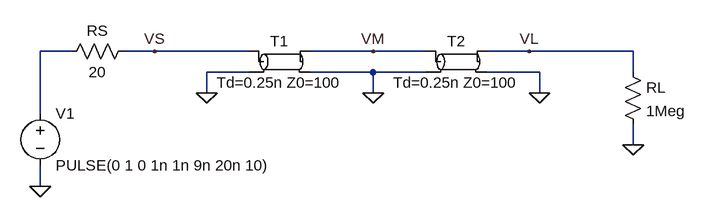
[diagram p0: schematic singleTrace.asc]
singleTrace.asc, the LTspice schematic file:
Version 4
SHEET 1 1128 680
WIRE 176 64 128 64
WIRE 304 64 256 64
WIRE 448 64 304 64
WIRE 640 64 544 64
WIRE 720 64 640 64
WIRE 880 64 816 64
WIRE 1040 64 880 64
WIRE 448 96 384 96
WIRE 640 96 544 96
WIRE 720 96 640 96
WIRE 896 96 816 96
WIRE 1040 96 1040 64
WIRE 384 128 384 96
WIRE 640 128 640 96
WIRE 896 128 896 96
WIRE 128 160 128 64
WIRE 1040 208 1040 176
WIRE 128 272 128 240
FLAG 128 272 0
FLAG 384 128 0
FLAG 640 128 0
FLAG 896 128 0
FLAG 1040 208 0
FLAG 304 64 VS
FLAG 640 64 VM
FLAG 880 64 VL
SYMBOL voltage 128 144 R0
WINDOW 123 0 0 Left 0
WINDOW 39 0 0 Left 0
SYMATTR InstName V1
SYMATTR Value PULSE(0 1 0 1n 1n 9n 20n 10)
SYMBOL tline 496 80 R0
SYMATTR InstName T1
SYMATTR Value Td=0.25n Z0=100
SYMBOL tline 768 80 R0
SYMATTR InstName T2
SYMATTR Value Td=0.25n Z0=100
SYMBOL res 1024 80 R0
SYMATTR InstName RL
SYMATTR Value 1Meg
SYMBOL res 272 48 R90
WINDOW 0 0 56 VBottom 2
WINDOW 3 32 56 VTop 2
SYMATTR InstName RS
SYMATTR Value 20

The netlist it stands for:
* singleTrace.asc
V1 N001 0 PULSE(0 1 0 1n 1n 9n 20n 10)
T1 VS 0 VM 0 Td=0.25n Z0=100
T2 VM 0 VL 0 Td=0.25n Z0=100
RL VL 0 1Meg
RS VS N001 20
.backanno
.end